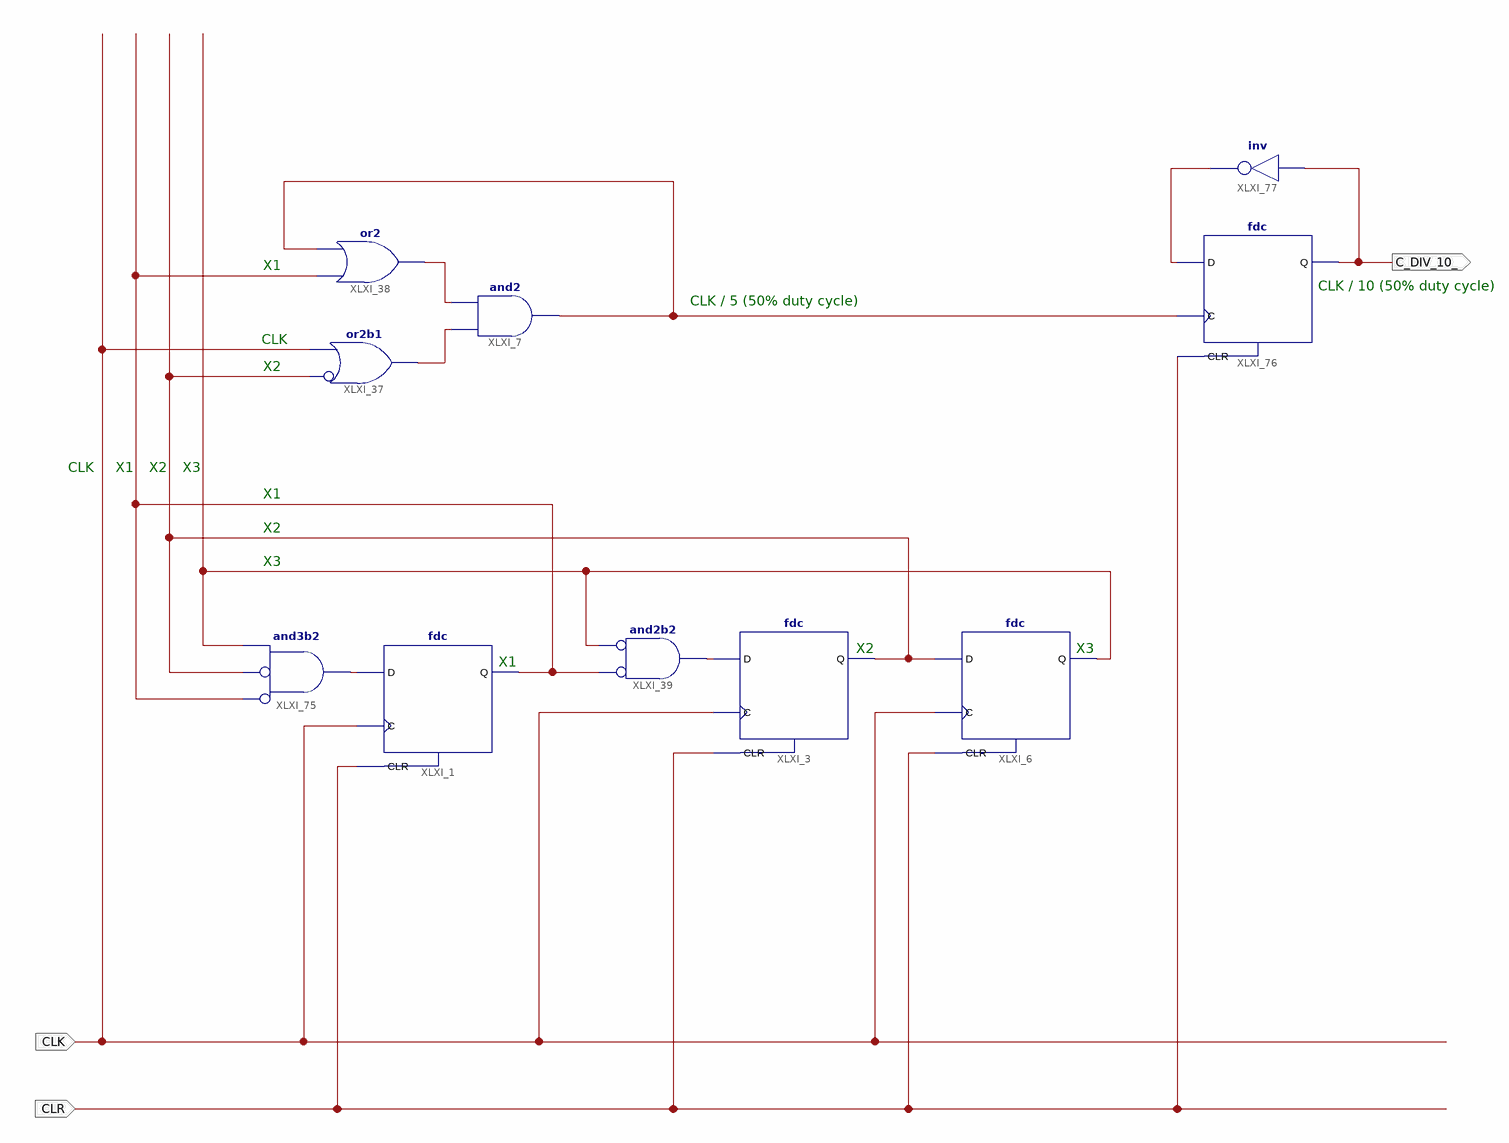
[diagram p0: schematic sheet 1]
// Xilinx ISE schematic clock_div_by_10.sch (spartan3e) as structural Verilog: 10 symbols, 3 ports
module clock_div_by_10 (
  input  CLR,
  input  CLK,
  output C_DIV_10_
);

  wire XLXN_18, XLXN_27, XLXN_78, XLXN_80, XLXN_83, XLXN_219, XLXN_220, XLXN_287, XLXN_302;

  fdc XLXI_1 (.C(CLK), .CLR(CLR), .D(XLXN_18), .Q(XLXN_80));
  fdc XLXI_3 (.C(CLK), .CLR(CLR), .D(XLXN_27), .Q(XLXN_78));
  fdc XLXI_6 (.C(CLK), .CLR(CLR), .D(XLXN_78), .Q(XLXN_83));
  and XLXI_39 (XLXN_27, ~XLXN_80, ~XLXN_83);  // and2b2
  and XLXI_7 (XLXN_287, XLXN_220, XLXN_219);
  or XLXI_37 (XLXN_220, ~XLXN_78, CLK);  // or2b1
  or XLXI_38 (XLXN_219, XLXN_80, XLXN_287);
  and XLXI_75 (XLXN_18, ~XLXN_80, ~XLXN_78, XLXN_83);  // and3b2
  fdc XLXI_76 (.C(XLXN_287), .CLR(CLR), .D(XLXN_302), .Q(C_DIV_10_));
  not XLXI_77 (XLXN_302, C_DIV_10_);

  // Notes on the sheet:
  //   X1
  //   CLK / 10 (50% duty cycle)
  //   CLK / 5 (50% duty cycle)
  //   CLK
  //   X2
  //   CLK
  //   X1
  //   X2
  //   X3
  //   X1
  //   X2
  //   X3
  //   X2
  //   X3
  //   X1
endmodule
